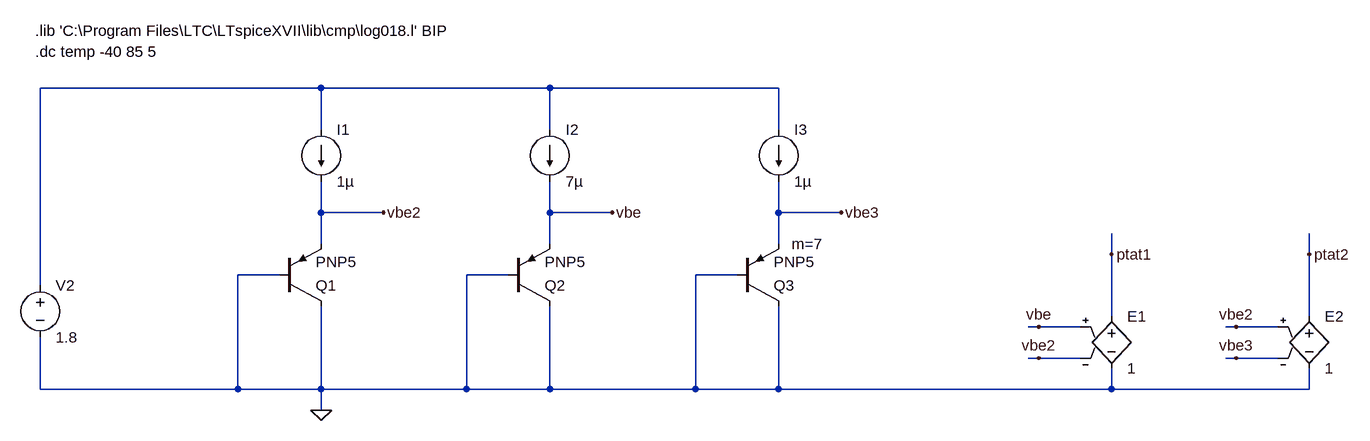
[diagram p0: schematic E2_BJT_PTAT.asc]
E2_BJT_PTAT.asc, the LTspice schematic file:
Version 4
SHEET 1 2248 752
WIRE 672 80 240 80
WIRE 1024 80 672 80
WIRE 1376 80 1024 80
WIRE 672 144 672 80
WIRE 1024 144 1024 80
WIRE 1376 144 1376 80
WIRE 672 272 672 224
WIRE 768 272 672 272
WIRE 1024 272 1024 224
WIRE 1120 272 1024 272
WIRE 1376 272 1376 224
WIRE 1472 272 1376 272
WIRE 672 320 672 272
WIRE 1024 320 1024 272
WIRE 1376 320 1376 272
WIRE 1888 336 1888 304
WIRE 2192 336 2192 304
WIRE 608 368 544 368
WIRE 960 368 896 368
WIRE 1312 368 1248 368
WIRE 240 384 240 80
WIRE 1888 432 1888 336
WIRE 2192 432 2192 336
WIRE 1776 448 1760 448
WIRE 1840 448 1776 448
WIRE 2080 448 2064 448
WIRE 2144 448 2080 448
WIRE 1776 496 1760 496
WIRE 1840 496 1776 496
WIRE 2080 496 2064 496
WIRE 2144 496 2080 496
WIRE 240 544 240 464
WIRE 544 544 544 368
WIRE 544 544 240 544
WIRE 672 544 672 416
WIRE 672 544 544 544
WIRE 896 544 896 368
WIRE 896 544 672 544
WIRE 1024 544 1024 416
WIRE 1024 544 896 544
WIRE 1248 544 1248 368
WIRE 1248 544 1024 544
WIRE 1376 544 1376 416
WIRE 1376 544 1248 544
WIRE 1888 544 1888 512
WIRE 1888 544 1376 544
WIRE 2192 544 2192 512
WIRE 2192 544 1888 544
WIRE 672 576 672 544
FLAG 672 576 0
FLAG 768 272 vbe2
FLAG 1120 272 vbe
FLAG 1472 272 vbe3
FLAG 1776 448 vbe
FLAG 1776 496 vbe2
FLAG 1888 336 ptat1
FLAG 2080 448 vbe2
FLAG 2080 496 vbe3
FLAG 2192 336 ptat2
SYMBOL voltage 240 368 R0
WINDOW 123 0 0 Left 0
WINDOW 39 0 0 Left 0
SYMATTR InstName V2
SYMATTR Value 1.8
SYMBOL pnp2 608 416 M180
SYMATTR InstName Q1
SYMATTR Value PNP5
SYMBOL current 672 144 R0
WINDOW 123 0 0 Left 0
WINDOW 39 0 0 Left 0
SYMATTR InstName I1
SYMATTR Value 1µ
SYMBOL pnp2 960 416 M180
SYMATTR InstName Q2
SYMATTR Value PNP5
SYMBOL current 1024 144 R0
WINDOW 123 0 0 Left 0
WINDOW 39 0 0 Left 0
SYMATTR InstName I2
SYMATTR Value 7µ
SYMBOL pnp2 1312 416 M180
WINDOW 123 84 96 Left 2
SYMATTR Value2 m=7
SYMATTR InstName Q3
SYMATTR Value PNP5
SYMBOL current 1376 144 R0
WINDOW 123 0 0 Left 0
WINDOW 39 0 0 Left 0
SYMATTR InstName I3
SYMATTR Value 1µ
SYMBOL e 1888 416 R0
SYMATTR InstName E1
SYMATTR Value 1
SYMBOL e 2192 416 R0
SYMATTR InstName E2
SYMATTR Value 1
TEXT 232 24 Left 2 !.dc temp -40 85 5
TEXT 232 -8 Left 2 !.lib 'C:\\Program Files\\LTC\\LTspiceXVII\\lib\\cmp\\log018.l' BIP

The netlist it stands for:
* E2_BJT_PTAT.asc
V2 N001 0 1.8
Q1 0 0 vbe2 0 PNP5
I1 N001 vbe2 1µ
Q2 0 0 vbe 0 PNP5
I2 N001 vbe 7µ
Q3 0 0 vbe3 0 PNP5 m=7
I3 N001 vbe3 1µ
E1 ptat1 0 vbe vbe2 1
E2 ptat2 0 vbe2 vbe3 1
.model NPN NPN
.model PNP PNP
.lib standard.bjt
.dc temp -40 85 5
.lib 'C:\Program Files\LTC\LTspiceXVII\lib\cmp\log018.l' BIP
.backanno
.end